# EAGLE design LED_Light_Bulb (EAGLE 6.5.0)
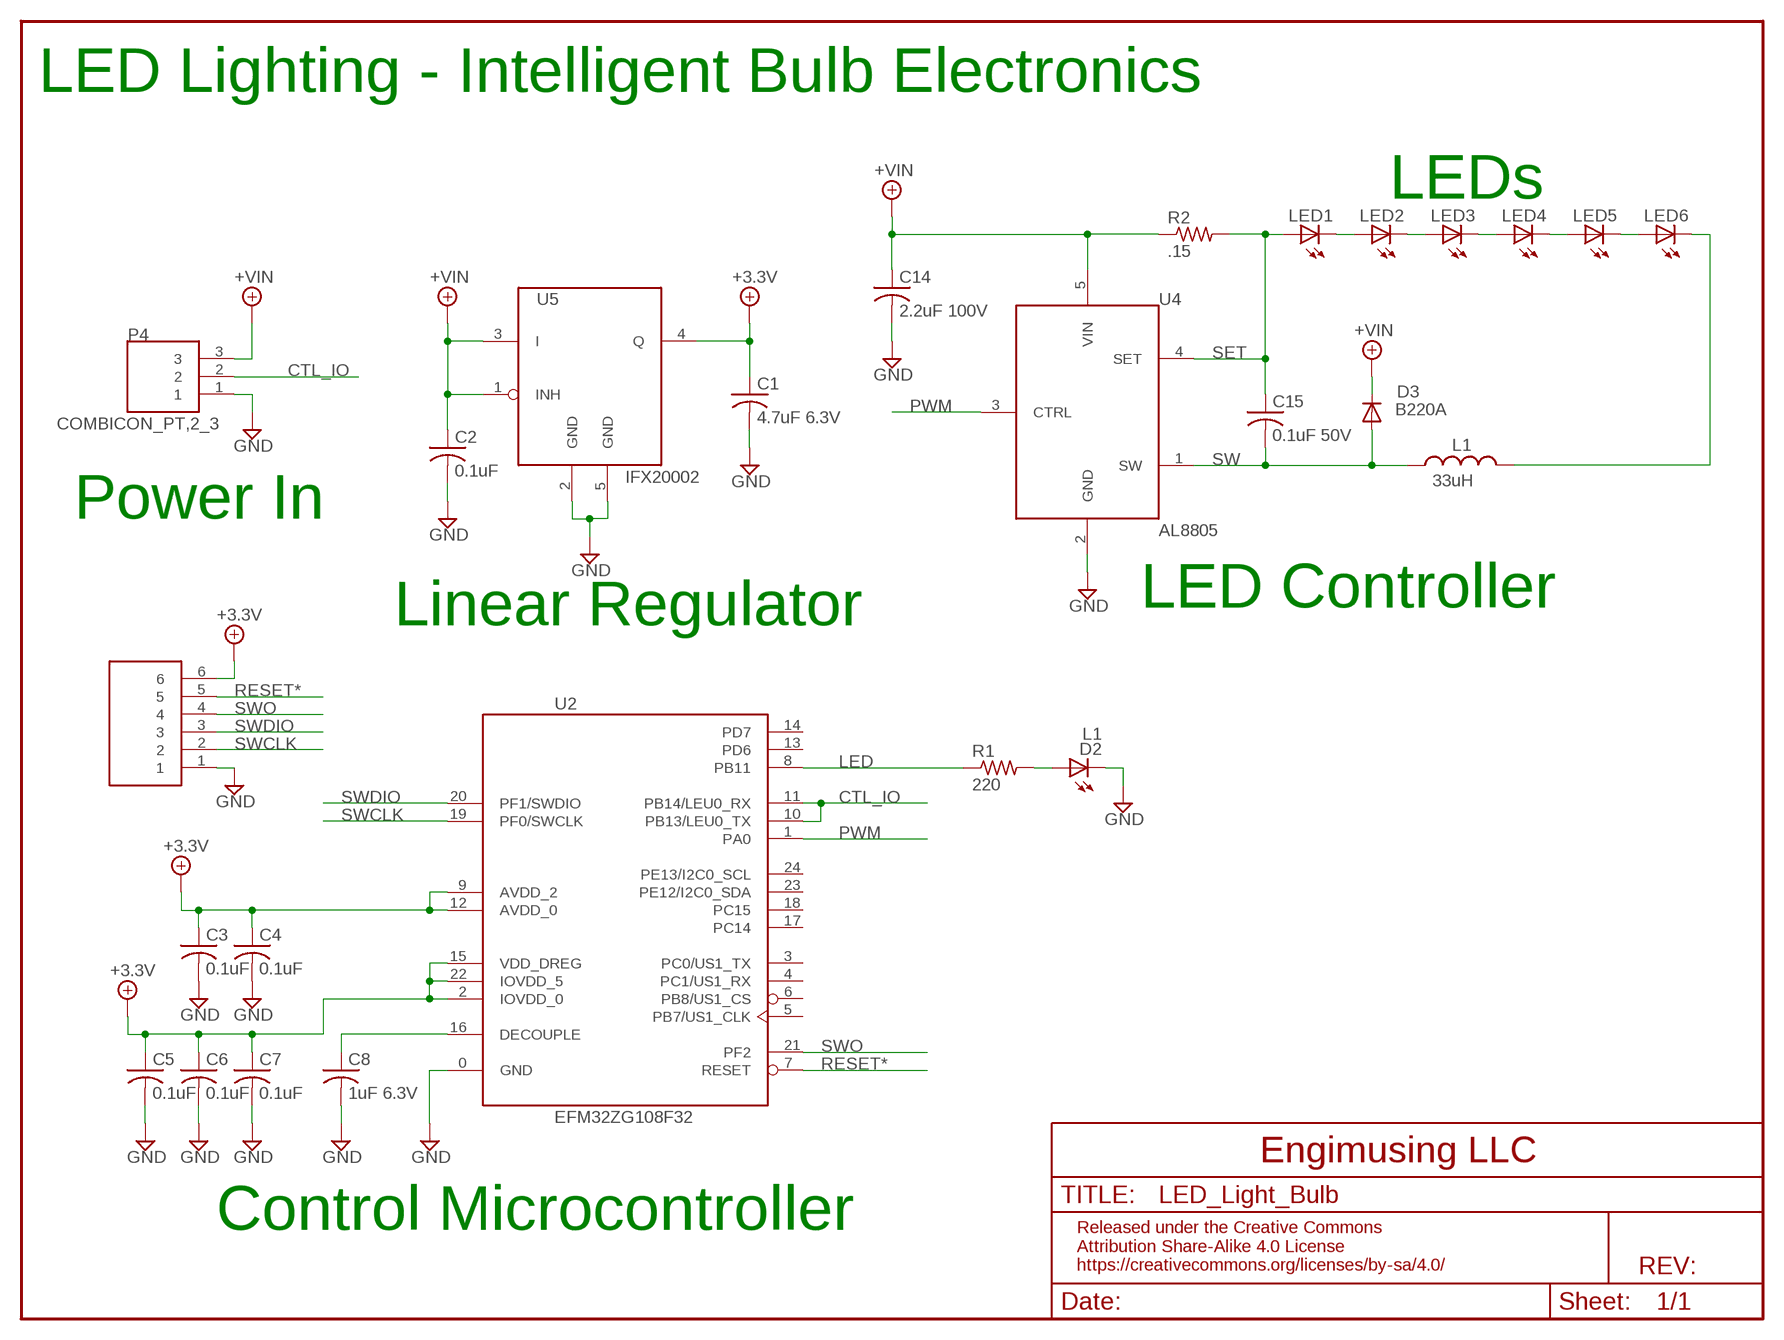
[diagram p0: schematic, sheet 1]

## Parts
C1  4.7uF 6.3V  C-USC0603  [C0603]
C2  0.1uF  C-USC0603  [C0603]
C3  0.1uF  C-USC0603  [C0603]
C4  0.1uF  C-USC0603  [C0603]
C5  0.1uF  C-USC0603  [C0603]
C6  0.1uF  C-USC0603  [C0603]
C7  0.1uF  C-USC0603  [C0603]
C8  1uF 6.3V  C-USC0603  [C0603]
C14  2.2uF 100V  C-USC1210K  [C1210K]
C15  0.1uF 50V  C-USC0805  [C0805]
D2  L1  LEDCHIP-LED0603  [CHIP-LED0603]
D3  B220A  DIODE  [DO214SMA]
L1  33uH  INDUCTOR  [SRN6045]
LED1  LED-MX3  [LED_5X5]
LED2  LED-MX3  [LED_5X5]
LED3  LED-MX3  [LED_5X5]
LED4  LED-MX3  [LED_5X5]
LED5  LED-MX3  [LED_5X5]
LED6  LED-MX3  [LED_5X5]
P3  DF11-6_STRAIGHT_PIN  [DF11SP-6-H]
P4  COMBICON_PT,2_3  [PT_2,5/3-5,0-H]
R1  220  R-USR0603  [R0603]
R2  .15  R-USR0805  [R0805]
U2  EFM32ZG108F32  [QFN24_5X5]
U4  AL8805  [SOT-23-5A]
U5  IFX20002  [PG-SCT595-5]

## Nets
+3.3V: C1.1 C3.1 C4.1 C5.1 C6.1 C7.1 P3.6 U2.2(IOVDD_0) U2.9(AVDD_2) U2.12(AVDD_0) U2.15(VDD_DREG) U2.22(IOVDD_5) U5.4(Q)
+VIN: C2.1 C14.1 D3.1(C) P4.3 R2.1 U4.5(VIN) U5.1(INH) U5.3(I)
CTL_IO: P4.2 U2.10(PB13/LEU0_TX) U2.11(PB14/LEU0_RX)
GND: C1.2 C2.2 C3.2 C4.2 C5.2 C6.2 C7.2 C8.2 C14.2 D2.C P3.1 P4.1 U2.0(GND) U4.2(GND) U5.2(GND) U5.5(GND)
LED: R1.1 U2.8(PB11)
N$1: C8.1 U2.16(DECOUPLE)
N$4: L1.2 LED6.C
N$5: D2.A R1.2
N$6: LED1.C LED2.A
N$7: LED2.C LED3.A
N$8: LED3.C LED4.A
N$9: LED4.C LED5.A
N$10: LED5.C LED6.A
PWM: U2.1(PA0) U4.3(CTRL)
RESET*: P3.5 U2.7(RESET)
SET: C15.1 LED1.A R2.2 U4.4(SET)
SW: C15.2 D3.2(A) L1.1 U4.1(SW)
SWCLK: P3.2 U2.19(PF0/SWCLK)
SWDIO: P3.3 U2.20(PF1/SWDIO)
SWO: P3.4 U2.21(PF2)
Unconnected: U2.3(PC0/US1_TX) U2.4(PC1/US1_RX) U2.5(PB7/US1_CLK) U2.6(PB8/US1_CS) U2.13(PD6) U2.14(PD7) U2.17(PC14) U2.18(PC15) U2.23(PE12/I2C0_SDA) U2.24(PE13/I2C0_SCL)

## Notes on the sheet
- LED Lighting - Intelligent Bulb Electronics
- LEDs
- Power In
- Linear Regulator | LED Controller
- Control Microcontroller

## Library data of the parts
C1-C8 C14 C15 = Engimusing:C-US: CAPACITOR, American symbol
D2 = led:LED: LED OSRAM: - CHIPLED LG R971, LG N971, LY N971, LG Q971, LY Q971, LO R971, LY R971 LH N974, LH R974 LS Q976, LO Q976, LY Q976 LO Q996 - Hyper CHIPLED LW Q18S LB Q993, LB Q99A, LB R99A - SideLED LS A670, LO A670, LY A670, LG A670, LP A670 LB A673, LV A673, LT A673, LW A673 LH A674 LY A675 LS A676, LA A676, LO A676, LY A676, LW A676 LS A679, LY A679, LG A679 - Hyper Micro SIDELED® LS Y876, LA Y876, LO Y876, LY Y876 LT Y87S - SmartLED LW L88C, LW L88S LB L89C, LB L89S, LG L890 LS L89K, LO L89K, LY L89K LS L896, LA L896, LO L896, LY L896 - TOPLED LS T670, LO T670, LY T670, LG T670, LP T670 LSG T670, LSP T670, LSY T670, LOP T670, LYG T670 LG T671, LOG T671, LSG T671 LB T673, LV T673, LT T673, LW T673 LH T674 LS T676, LA T676, LO T676, LY T676, LB T676, LH T676, LSB T676, LW T676 LB T67C, LV T67C, LT T67C, LS T67K, LO T67K, LY T67K, LW E67C LS E67B, LA E67B, LO E67B, LY E67B, LB E67C, LV E67C, LT E67C LW T67C LS T679, LY T679, LG T679 LS T770, LO T770, LY T770, LG T770, LP T770 LB T773, LV T773, LT T773, LW T773 LH T774 LS E675, LA E675, LY E675, LS T675 LS T776, LA T776, LO T776, LY T776, LB T776 LHGB T686 LT T68C, LB T68C - Hyper Mini TOPLED® LB M676 - Mini TOPLED Santana® LG M470 LS M47K, LO M47K, LY M47K Source: http://www.osram.convergy.de LUXEON: - LUMILED® LXK2-PW12-R00, LXK2-PW12-S00, LXK2-PW14-U00, LXK2-PW14-V00 LXK2-PM12-R00, LXK2-PM12-S00, LXK2-PM14-U00 LXK2-PE12-Q00, LXK2-PE12-R00, LXK2-PE12-S00, LXK2-PE14-T00, LXK2-PE14-U00 LXK2-PB12-K00, LXK2-PB12-L00, LXK2-PB12-M00, LXK2-PB14-N00, LXK2-PB14-P00, LXK2-PB14-Q00 LXK2-PR12-L00, LXK2-PR12-M00, LXK2-PR14-Q00, LXK2-PR14-R00 LXK2-PD12-Q00, LXK2-PD12-R00, LXK2-PD12-S00 LXK2-PH12-R00, LXK2-PH12-S00 LXK2-PL12-P00, LXK2-PL12-Q00, LXK2-PL12-R00 Source: www.luxeon.com KINGBRIGHT: KA-3528ASYC Source: www.kingbright.com
D3 = Engimusing:DIODE: Diode SMA Model Volts Amps Type Vf Vr Digikey # Notes SSA34-E3 40V 3A Schottky 480mV @ 3A 200uA @ 40V SSA34-E3/61TGITR-ND CDBA120-G 20V 1A Schottky 500mV @ 1A 500uA @ 20V 641-1014-6-ND REEL MBRA210 10V 2A Schottky 350mV @ 2A 700uA @ 10V MBRA210LT3 SOD-123 Model Volts Amps Type Vf Vr Order # Notes BAT54T1G 30V 200mA Schottky 800mV @ 200mA 2uA @ 25V BAT54T1GOSTR-ND B0530W 30V 500mA Schottky 430mV @ 500mA 130uA @ 30V B0530W-FDICT-ND REEL MBR120 1A 20V Schottky 340mV @ 1A MBR120VLSFT1GOSCT-ND SOD-323 Model Volts Amps Type Vf Vr Order # Notes PMEG2005EJ 20V 500mA Schottky 355mV @ 500mA 568-4110-1-ND ZLLS410 10V 570mA Schottky 380mV @ 570mA ZLLS410CT-ND 1N4148WS 75V 150mA Silicon/Simple 1V 1N4148WSFSCT-ND REEL SOD-523 Model Volts Amps Type Vf Vr Order # Notes BAT54XV2 30V 200mA Schottky 0.8V @ 100mA BAT54XV2CT-ND TB751S 30V 30mA Schottky RB751S-40TE61CT-ND SOT23-R/W (R = Solder Paste/Reflow Ovens, W = Hand-Soldering) Model Volts Amps Type Vf Vr Order # Notes BAT54FILM 40V 300mA Schottky 497-7162-1-ND
L1 = Engimusing:INDUCTOR
LED1-LED6 = Engimusing:LED: LED OSRAM: - CHIPLED LG R971, LG N971, LY N971, LG Q971, LY Q971, LO R971, LY R971 LH N974, LH R974 LS Q976, LO Q976, LY Q976 LO Q996 - Hyper CHIPLED LW Q18S LB Q993, LB Q99A, LB R99A - SideLED LS A670, LO A670, LY A670, LG A670, LP A670 LB A673, LV A673, LT A673, LW A673 LH A674 LY A675 LS A676, LA A676, LO A676, LY A676, LW A676 LS A679, LY A679, LG A679 - Hyper Micro SIDELED® LS Y876, LA Y876, LO Y876, LY Y876 LT Y87S - SmartLED LW L88C, LW L88S LB L89C, LB L89S, LG L890 LS L89K, LO L89K, LY L89K LS L896, LA L896, LO L896, LY L896 - TOPLED LS T670, LO T670, LY T670, LG T670, LP T670 LSG T670, LSP T670, LSY T670, LOP T670, LYG T670 LG T671, LOG T671, LSG T671 LB T673, LV T673, LT T673, LW T673 LH T674 LS T676, LA T676, LO T676, LY T676, LB T676, LH T676, LSB T676, LW T676 LB T67C, LV T67C, LT T67C, LS T67K, LO T67K, LY T67K, LW E67C LS E67B, LA E67B, LO E67B, LY E67B, LB E67C, LV E67C, LT E67C LW T67C LS T679, LY T679, LG T679 LS T770, LO T770, LY T770, LG T770, LP T770 LB T773, LV T773, LT T773, LW T773 LH T774 LS E675, LA E675, LY E675, LS T675 LS T776, LA T776, LO T776, LY T776, LB T776 LHGB T686 LT T68C, LB T68C - Hyper Mini TOPLED® LB M676 - Mini TOPLED Santana® LG M470 LS M47K, LO M47K, LY M47K Source: http://www.osram.convergy.de LUXEON: - LUMILED® LXK2-PW12-R00, LXK2-PW12-S00, LXK2-PW14-U00, LXK2-PW14-V00 LXK2-PM12-R00, LXK2-PM12-S00, LXK2-PM14-U00 LXK2-PE12-Q00, LXK2-PE12-R00, LXK2-PE12-S00, LXK2-PE14-T00, LXK2-PE14-U00 LXK2-PB12-K00, LXK2-PB12-L00, LXK2-PB12-M00, LXK2-PB14-N00, LXK2-PB14-P00, LXK2-PB14-Q00 LXK2-PR12-L00, LXK2-PR12-M00, LXK2-PR14-Q00, LXK2-PR14-R00 LXK2-PD12-Q00, LXK2-PD12-R00, LXK2-PD12-S00 LXK2-PH12-R00, LXK2-PH12-S00 LXK2-PL12-P00, LXK2-PL12-Q00, LXK2-PL12-R00 Source: www.luxeon.com KINGBRIGHT: KA-3528ASYC Source: www.kingbright.com
P3 = engimusing_conectors:DF11-6: CONNEECTOR 6 POS SM
P4 = Engimusing:COMBICON_PT,2_3: CONNECTOR 3POS SCREW CONECTION
R1 R2 = Engimusing:R-US: RESISTOR, American symbol
U2 = Engimusing:EFM32ZG108
U4 = Engimusing:AL8805
U5 = Engimusing:IFX20002

## Net classes
2 gnd: width 0.254 mm, drill 0.61 mm, clearance 0.254 mm

## Board
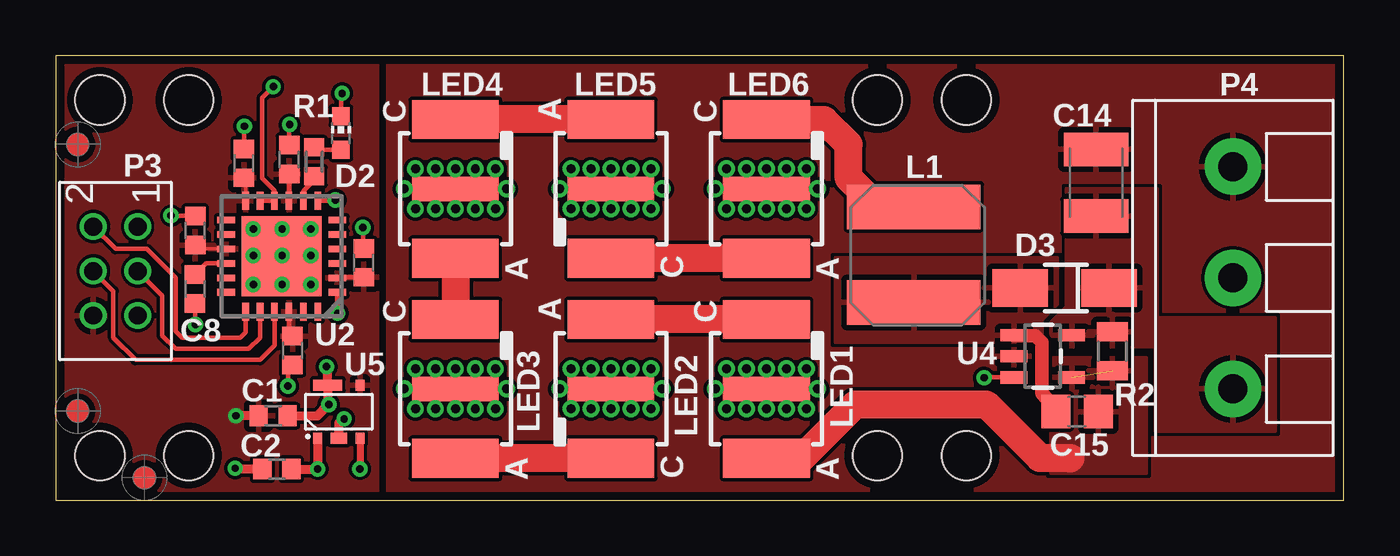
[diagram p1: board, top side]
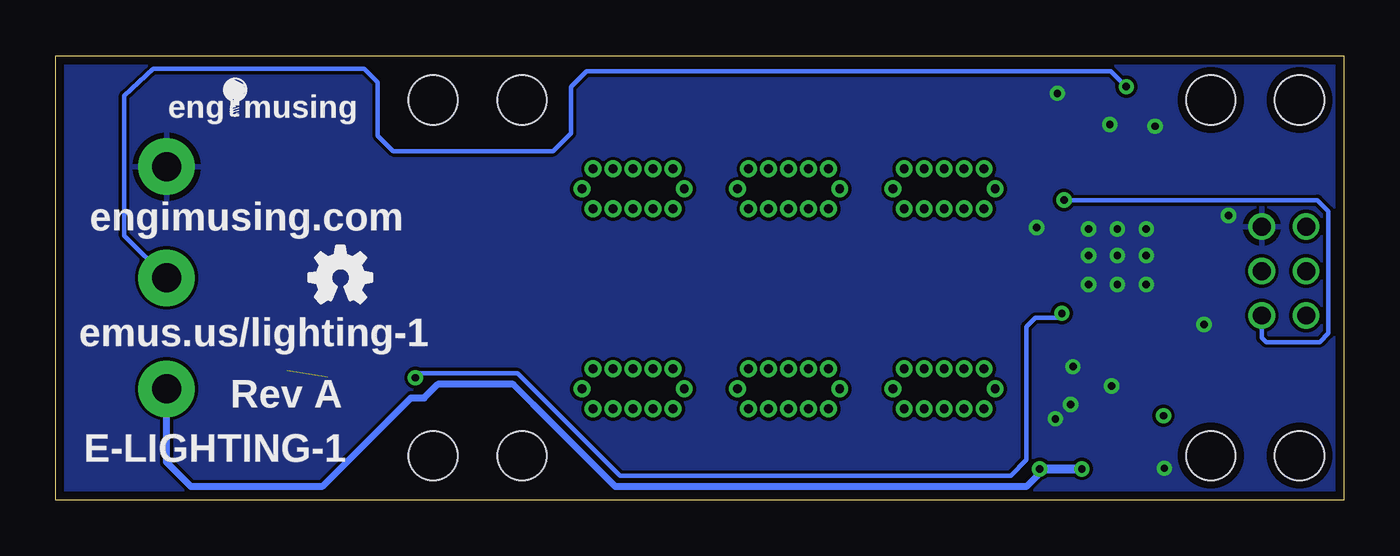
[diagram p2: board, bottom side, seen from below]

Size 58 x 20 mm. Coordinates in mm from the lower left corner, seen from the top.
Outline: 0,20 0,0 58,0 58,20 0,20
Copper layers (1*16): Top 0.0356mm / dielectric 1.5011mm / Bottom 0.0356mm
Design rules "OshPark-2Lyr *": minimum track width 6mil, minimum drill 13mil, track to track 6mil, track to pad 6mil, pad to pad 6mil, via to via 6mil, smd to smd 6mil, copper to edge 15mil, drill to drill 6mil, minimum pad ring 7mil, minimum via ring 7mil, stop-mask expansion 3mil, vias tented up to drill 13mil, thermal gap 10mil
Holes 2.2 mm at 2,18 2,2 6,2 6,18 37,2 41,2 41,18 37,18

### Footprints (pad centres in the part's own frame; a part is rotated, then mirrored left to right if it is on the bottom)
C0603 = smd 0.825 x 0.925: 1 -0.65,0; 2 0.65,0
C1210K = smd 1.5 x 2.9: 1 -1.5,0; 2 1.5,0
C0805 = smd 1.3 x 1.5: 1 -0.95,0; 2 0.95,0
CHIP-LED0603 = smd 0.8 x 0.8: A 0,-0.75; C 0,0.75
DO214SMA = smd 2.5 x 1.7: 1 -2,0; 2 2,0
SRN6045 = smd 2 x 6: 1 -2.15,0; 2 2.15,0
LED_5X5 = drill 0.4: 1 -0.9,1.8; 2 -0.9,0.9; 3 -0.9,0; 4 -0.9,-0.9; 5 -0.9,-1.8; 6 0.9,1.8; 7 0.9,0.9; 8 0.9,0; 9 0.9,-0.9; 10 0.9,-1.8; 11 0,-2.3; 12 0,2.3 | smd 1.75 x 3.9: A -3.125,0; C 3.125,0 | smd 1.1 x 3.9: P 0,0
DF11SP-6-H = drill 0.8: 1 2,-1; 2 2,1; 3 0,-1; 4 0,1; 5 -2,-1; 6 -2,1
PT_2,5/3-5,0-H = drill 1.3 pad 2.54: 1 -5,0; 2 0,0; 3 5,0
R0603 = smd 0.8 x 0.9: 1 -0.65,0; 2 0.65,0
R0805 = smd 0.85 x 1.4: 1 -0.875,0; 2 0.875,0
QFN24_5X5 = smd 3.6 x 3.6: 0 0,0 | smd 0.8 x 0.3: 1 -2.5,1.625; 2 -2.5,0.975; 3 -2.5,0.325; 4 -2.5,-0.325; 5 -2.5,-0.975; 6 -2.5,-1.625; 13 2.5,-1.625; 14 2.5,-0.975; 15 2.5,-0.325; 16 2.5,0.325; 17 2.5,0.975; 18 2.5,1.625 | smd 0.3 x 0.8: 7 -1.625,-2.5; 8 -0.975,-2.5; 9 -0.325,-2.5; 10 0.325,-2.5; 11 0.975,-2.5; 12 1.625,-2.5; 19 1.625,2.5; 20 0.975,2.5; 21 0.325,2.5; 22 -0.325,2.5; 23 -0.975,2.5; 24 -1.625,2.5
SOT-23-5A = smd 0.55 x 1.2: 1 -0.95,-1.3; 2 0,-1.3; 3 0.95,-1.3; 4 0.95,1.3; 5 -0.95,1.3
PG-SCT595-5 = smd 0.4 x 0.5: 1 -0.95,-1.2; 3 0.95,-1.2; 4 0.95,1.2 | smd 0.75 x 0.5: 2 0,-1.2 | smd 1.3 x 0.5: 5 -0.5,1.2

### Placement (x,y rotation side)
C1  9.8,3.79 0 top
C2  9.96,1.39 180 top
C3  10.52,15.32 90 top
C4  8.49,15.15 90 top
C5  6.29,12.12 90 top
C6  10.66,6.73 270 top
C7  13.88,10.67 90 top
C8  6.28,9.49 270 top
C14  46.84,14.27 90 top
C15  45.99,3.98 180 top
D2  12.85,16.51 0 top
D3  45.43,9.54 180 top
L1  38.64,11.04 90 top
LED1  32,5 90 top
LED2  25,5 270 top
LED3  18,5 90 top
LED4  18,14 90 top
LED5  25,14 270 top
LED6  32,14 90 top
P3  2.7,10.3 90 top
P4  53,10 270 top
R1  11.64,15.22 90 top
R2  47.57,6.7 270 top
U2  10.18,10.97 180 top
U4  44.44,6.46 270 top
U5  12.76,3.97 0 top
U$1  [FIDUCIAL_G10]  1,16 270 top
U$2  [FIDUCIAL_G10]  4,1 270 top
U$3  [OSHW_FILLX100_NOTEXT]  46.59,8.89 0 bottom
U$4  [LOGO]  48.55,17.54 0 bottom
U$5  [FIDUCIAL_G10]  1,4 270 top

### Tracks (layer width: path | path; a pad name or v marks a point on that pad's centre or on a via)
+3.3V  (via drill 0.33 pad 0.61)
  Top 0.152: U2.15 6.47,11.3 C5.1 | U2.12 8.56,14.47 C4.1
  Top 0.2: C7.1 12.71,10.02 U2.2 | U2.22 10.51,7.35 C6.1 | U2.9 10.51,14.65 C3.1
  Top 0.406: C1.1 v8.12,3.79
  pour Top (rank 2): 0,20 0,0 14.5,0 14.5,20
+VIN  (via drill 0.33 pad 0.61)
  Top 0.305: U5.3 v13.71,1.41 v13.7,1.4
  Top 0.406: U5.1 v11.81,1.41 v11.8,1.4 11.79,1.39 C2.1
  Bottom 0.3: 36.5,4.3 37.4,5.2
  Bottom 0.305: v13.7,1.4 13.7,1.2 14.3,0.6 32.8,0.6 36.5,4.3 | P4.3 53,1.7 51.9,0.6 46,0.6 42,4.6 41.4,4.6 40.8,5.2 37.4,5.2
  Bottom 0.406: v13.7,1.4 v11.8,1.4
  pour Top: 45.5,14 45.5,8.7 44.8,8 44.8,6.9 49.5,6.9 49.5,3.1 54.9,3.1 54.9,8.2 49.6,8.2 49.6,14
CTL_IO  (via drill 0.33 pad 0.61)
  Top 0.2: U2.11 U2.10 9.86,13.91 9.3,14.47 9.3,18.1 v9.8,18.6
  Bottom 0.2: P4.2 54.9,11.9 54.9,18.2 53.6,19.4 44.1,19.4 43.5,18.8 43.5,16.4 42.8,15.7 35.6,15.7 34.8,16.5 34.8,18.6 34.1,19.3 10.5,19.3 v9.8,18.6
GND  (via drill 0.33 pad 0.61)
  Top 0.2: C7.2 13.84,11.61 v13.84,12.26 | U2.0 10.27,10.97 v11.5,12.2 v11.5,11 | v11.5,11 v11.5,9.7 v10.2,9.7 v10.2,11 | v10.2,12.2 v10.2,11 | v10.2,11 v11.5,11 | v11.5,11 10.4,11 v8.9,9.7 9.1,10.9 v8.9,11 v8.9,12.2 | C4.2 8.49,16.29 v8.5,16.82 | C3.2 10.52,16.38 v10.54,16.89 | D2.C 12.85,18.25 v12.9,18.3 | C6.2 10.47,5.73 v10.46,5.13 | C5.2 5.91,12.79 5.9,12.8 v5.2,12.8 | C8.2 6.27,7.92 v6.3,7.9
  Top 0.406: v12.2,6 12.26,5.94 U5.5 12.26,4.44 v12.3,4.3 11.79,3.79 C1.2 | U5.2 12.76,3.46 v12.99,3.65 | C2.2 8.12,1.39 v8.08,1.43
  pour Top (rank 2): 15,20 58,20 58,0 15,0
  pour Bottom: 0,20 0,0 58,0 58,20
LED
  Top 0.2: U2.8 11.16,13.78 11.17,13.92 11.64,14.4 R1.1
N$1
  Top 0.2: U2.16 6.78,10.65 C8.1
N$4
  Top 1.27: L1.2 38.53,13.46 36.7,13.5 35.7,14.5 35.7,16 34.6,17.1 32.02,17.1 LED6.C
N$5
  Top 0.2: D2.A 11.68,15.76 R1.2
N$6
  Top 1.27: LED1.C LED2.A
N$7
  Top 1.27: LED2.C LED3.A
N$8
  Top 1.27: LED4.A LED3.C
N$9
  Top 1.27: LED5.A LED4.C
N$10
  Top 1.27: LED6.A LED5.C
PWM  (via drill 0.33 pad 0.61)
  Top 0.2: U4.3 41.81,5.51 v41.8,5.5 | U2.1 12.68,8.42 v12.7,8.4
  Bottom 0.2: v12.7,8.4 12.9,8.2 13.9,8.2 14.3,7.8 14.3,1.8 15,1.1 32.6,1.1 37.2,5.7 41.6,5.7 v41.8,5.5
RESET*  (via drill 0.33 pad 0.61)
  Top 0.2: U2.7 12.57,13.47 v12.6,13.5
  Bottom 0.2: v12.6,13.5 1.2,13.5 0.7,13 0.7,7.5 1.1,7.1 3.5,7.1 3.7,7.3 P3.5
SET  (1 unrouted)
  Top 1.27: LED1.A 33.58,1.88 36,4.3 41.9,4.3 44.3,1.9 45.7,1.9 45.67,1.88
  pour Top: 49.1,6.4 44.8,6.4 44.8,1.2 49.1,1.2
SW
  Top 0.61: C15.2 44.84,4.34 44.4,4.8 44.4,7.1 44.1,7.4 43.16,7.4 U4.1
  pour Top: 35.1,10.9 35.1,7.1 44.4,7.1 44.4,8.1 45.1,8.8 45.1,10.9
SWCLK
  Top 0.2: U2.19 8.56,7.56 8.3,7.3 5.7,7.3 5.4,7.6 5.4,10 4.1,11.3 2.7,11.3 P3.2
SWDIO
  Top 0.2: U2.20 9.21,7.31 8.7,6.8 5.4,6.8 4.8,7.4 4.8,9.2 P3.3
SWO
  Top 0.2: U2.21 9.86,6.96 9.2,6.3 3.6,6.3 2.6,7.3 2.6,9.4 P3.4

### Text on the board
bPlace: engimusing.com | emus.us/lighting-1 | Rev A | E-LIGHTING-1